# Altium schematic sheet Buck-Boost converter (B).SchDoc
size A4; SheetNumber: 6; SheetTotal: 8
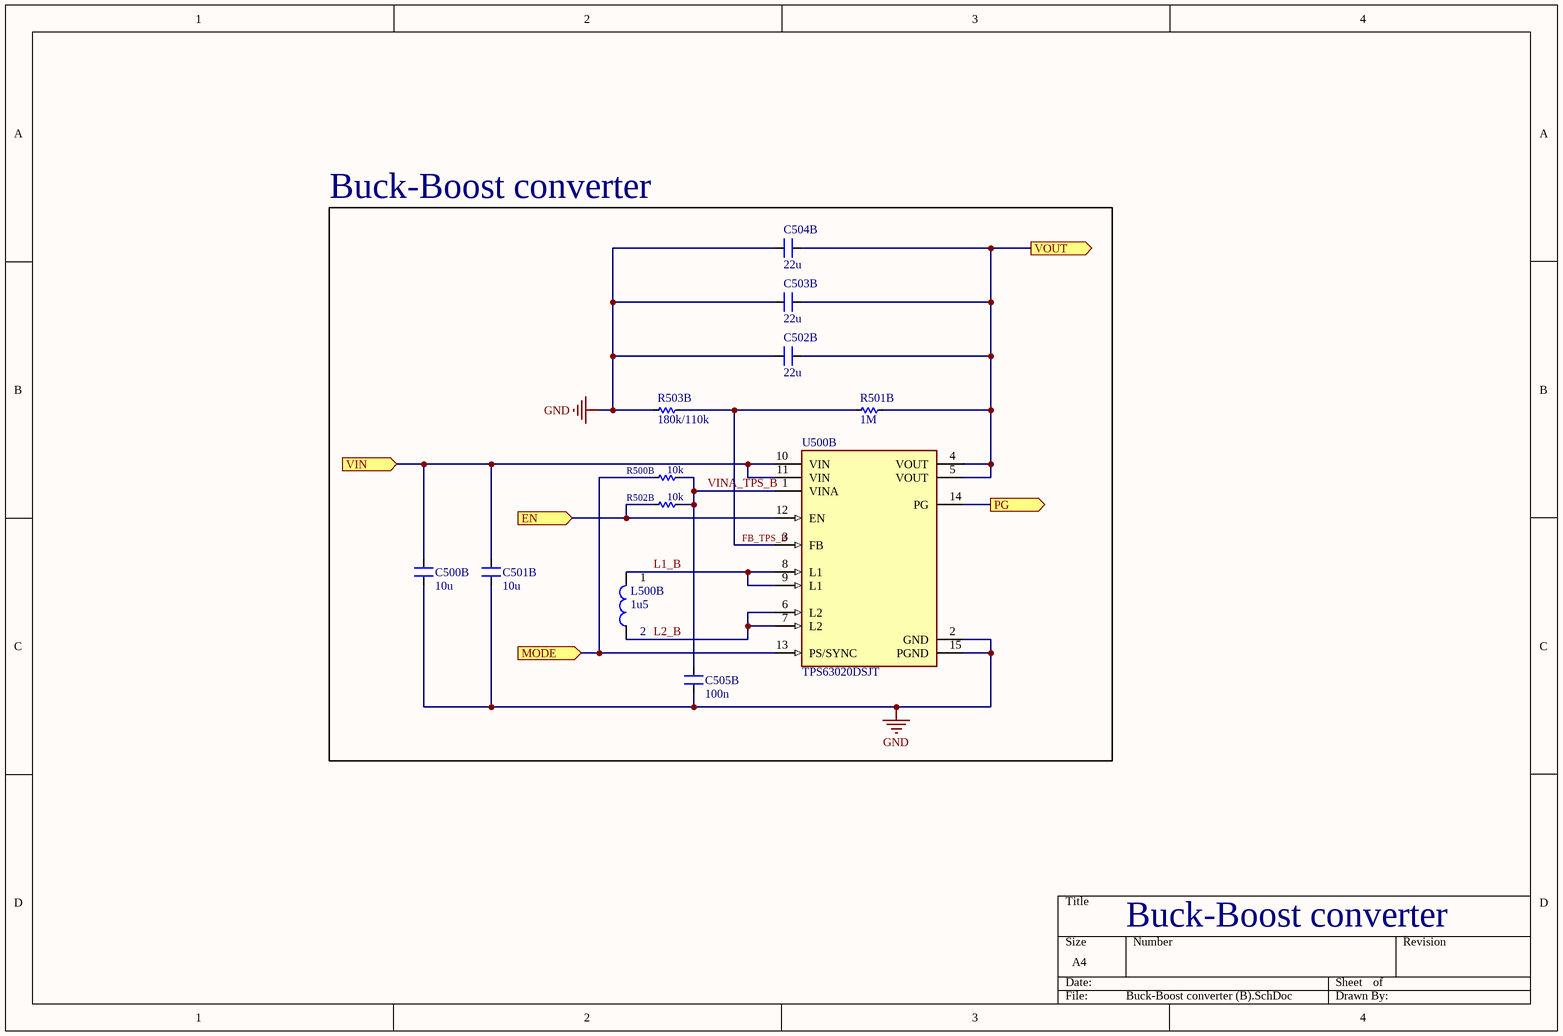
[diagram p0: Buck-Boost converter (B).SchDoc]

## Parts
C500B  10u  [CN-SMD-0603]
C501B  10u  [CN-SMD-0603]
C502B  22u  [CN-SMD-0603]
C503B  22u  [CN-SMD-0603]
C504B  22u  [CN-SMD-0603]
C505B  100n  [CN-SMD-0603]
L500B  1u5  [L-SMD-0630]
R500B  10k  [RES-SMD-0603]
R501B  1M  [RES-SMD-0603]
R502B  10k  [RES-SMD-0603]
R503B  180k/110k  [RES-SMD-0603]
U500B  TPS63020DSJT  [FP-DSJ0014A-MFG]

## Ports
EN (in, see Buck-Boost converter (A)[2C]), MODE (in, see Buck-Boost converter (A)[2C]), PG (out, see Buck-Boost converter (A)[3C], MPPT CC CV charger (A)[3B], MPPT CC CV charger (B)[3B]), VIN (in, see Buck-Boost converter (A)[1B], Ideal Diode[1B], Ideal Diode[3B]), VOUT (out, see Buck-Boost converter (A)[3B])

## Nets
GND: C500B.1 C501B.1 C502B.2 C503B.2 C504B.2 C505B.1 R503B.2 U500B.2(GND) U500B.15(PGND)
EN: R502B.2 U500B.12(EN) ; port EN
FB_TPS_B: R501B.2 R503B.1 U500B.3(FB)
L1_B: L500B.2 U500B.8(L1) U500B.9(L1)
L2_B: L500B.1 U500B.6(L2) U500B.7(L2)
MODE: R500B.2 U500B.13(PS/SYNC) ; port MODE
PG: U500B.14(PG) ; port PG
VIN: C500B.2 C501B.2 U500B.10(VIN) U500B.11(VIN) ; port VIN
VINA_TPS_B: C505B.2 R500B.1 R502B.1 U500B.1(VINA)
VOUT: C502B.1 C503B.1 C504B.1 R501B.1 U500B.4(VOUT) U500B.5(VOUT) ; port VOUT

## Notes on the sheet
- Buck-Boost converter
- (near L500B) 1
- (near L500B) 2

## Library data of the parts
C500B C501B C502B C503B C504B C505B = CN: Value: 33pF
L500B = L-SMD-1: partNo: 78477010; Manufacturer: Wurth Elektronik; Inductance: 1.0 μH; ComponentLink1Description: Manufacturer; ComponentLink1URL: http://www.we-online.de; Created by: Baojun Chen; Created Date: Nov.2015; ComponentLink2Description: Datasheet; ComponentLink2URL: http://katalog.we-online.de/pbs/datasheet/78477010.pdf
R500B R501B R502B R503B = Res-SMD: Resistor; Manufacturer: Generic Components; Class: Passive; Published: 08/06/2000; Publisher: Altium Hobart Technology Centre
U500B = CMP-2000-07282-2: IC REG BCK BST ADJ 3.5A 14VSON; Manufacturer: Texas Instruments; Switching Frequency: 2400kHz; Output Voltage: 1.2-5.5V; Nominal Supply Current: 25uA; Standoff Height: 0mm; Switching Topology: Buck-Boost; Min Supply Voltage: 1.8V; Output Type: AdjustableProgrammable; Max Junction Temp: +125°C; Number Of Outputs: 1; Output Current: 3A; Max Supply Voltage: 5.5V; ComponentLink2URL: https://www.ti.com/lit/ds/symlink/tps63020.pdf; Ambient Temperature Range High: +85°C; Digikey Description: IC REG BCK BST ADJ 3.5A 14VSON; Ambient Temperature Range Low: -40°C; Manufacturer Part Number: TPS63020DSJT; Automotive: No; Package: DSJ0014A; Category: IC; Temperature Range High: +85°C; Temperature: -40°C to +85°C; Octopart: https://octopart.com/tps63020dsjt-texas+instruments-12976119; Temperature Range Low: -40°C; Device Class L3: Voltage Regulators - Switching; Device Class L2: Power Management ICs; RoHS: TRUE; Lead Free: Yes; Height: 1mm; Device Class L1: Integrated Circuits (ICs); Mouser Description: Voltage Regulators - Switching Regulators 93% Eff Buck-Boost Converter; ComponentLink2Description: Datasheet